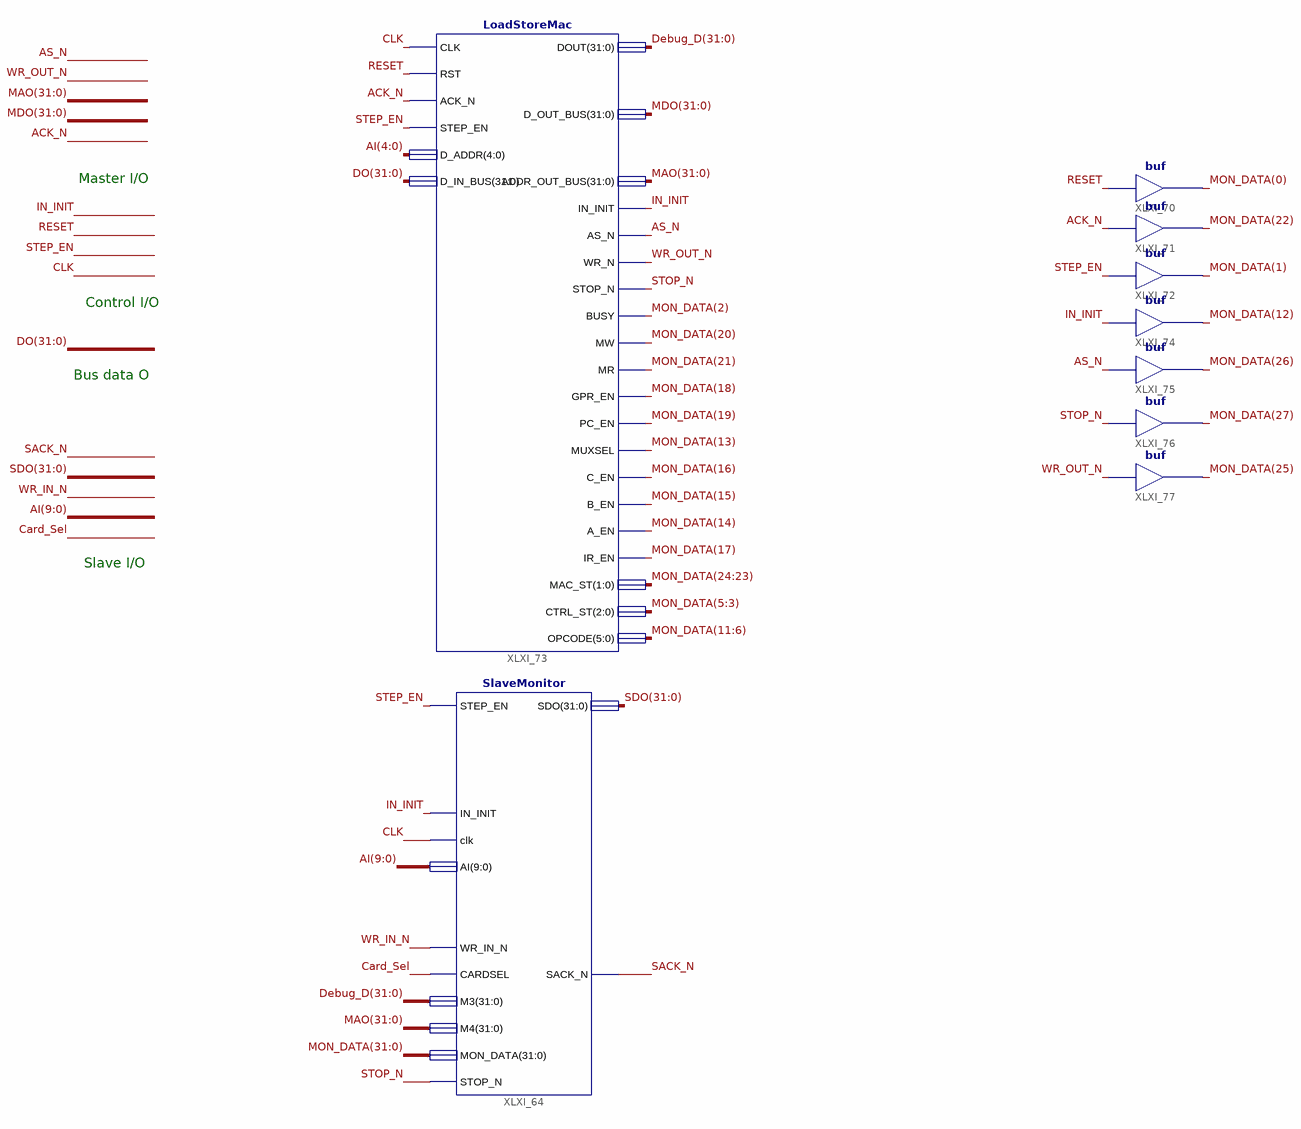
[diagram p0: schematic sheet 1]
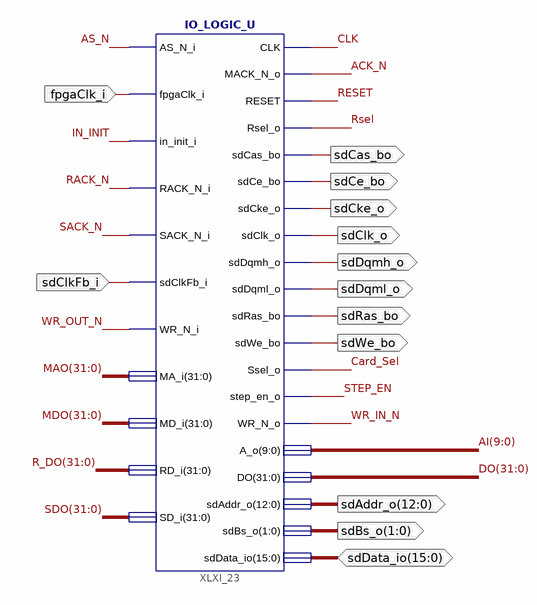
[diagram p1: schematic sheet 2]
// Xilinx ISE schematic Top_Level.sch (spartan6) as structural Verilog: 10 symbols, 13 ports
module Top_Level (
  input  fpgaClk_i,
  input  sdClkFb_i,
  inout  [15:0] sdData_io,
  output sdClk_o,
  output [1:0] sdBs_o,
  output sdDqml_o,
  output sdDqmh_o,
  output sdWe_bo,
  output sdCas_bo,
  output sdRas_bo,
  output sdCe_bo,
  output sdCke_o,
  output [12:0] sdAddr_o
);

  wire ACK_N, AS_N, Card_Sel, CLK, IN_INIT, RACK_N, RESET, Rsel, SACK_N, STEP_EN, STOP_N, WR_IN_N, WR_OUT_N;
  wire [9:0] AI;
  wire [31:0] Debug_D, DO, MAO, MDO, MON_DATA, R_DO, SDO;

  IO_LOGIC_U XLXI_23 (
    .AS_N_i(AS_N), .fpgaClk_i(fpgaClk_i), .in_init_i(IN_INIT), .RACK_N_i(RACK_N), .SACK_N_i(SACK_N),
    .sdClkFb_i(sdClkFb_i), .WR_N_i(WR_OUT_N), .MA_i(MAO), .MD_i(MDO), .RD_i(R_DO), .SD_i(SDO), .CLK(CLK),
    .MACK_N_o(ACK_N), .RESET(RESET), .Rsel_o(Rsel), .sdCas_bo(sdCas_bo), .sdCe_bo(sdCe_bo),
    .sdCke_o(sdCke_o), .sdClk_o(sdClk_o), .sdDqmh_o(sdDqmh_o), .sdDqml_o(sdDqml_o), .sdRas_bo(sdRas_bo),
    .sdWe_bo(sdWe_bo), .Ssel_o(Card_Sel), .step_en_o(STEP_EN), .WR_N_o(WR_IN_N), .A_o(AI), .DO(DO),
    .sdAddr_o(sdAddr_o), .sdBs_o(sdBs_o), .sdData_io(sdData_io));
  buf XLXI_70 (MON_DATA[0], RESET);
  buf XLXI_71 (MON_DATA[22], ACK_N);
  buf XLXI_72 (MON_DATA[1], STEP_EN);
  LoadStoreMac XLXI_73 (
    .CLK(CLK), .RST(RESET), .ACK_N(ACK_N), .STEP_EN(STEP_EN), .D_ADDR(AI[4:0]), .D_IN_BUS(DO),
    .BUSY(MON_DATA[2]), .IN_INIT(IN_INIT), .MW(MON_DATA[20]), .MR(MON_DATA[21]), .GPR_EN(MON_DATA[18]),
    .PC_EN(MON_DATA[19]), .MUXSEL(MON_DATA[13]), .C_EN(MON_DATA[16]), .B_EN(MON_DATA[15]),
    .A_EN(MON_DATA[14]), .IR_EN(MON_DATA[17]), .DOUT(Debug_D), .D_OUT_BUS(MDO), .ADDR_OUT_BUS(MAO),
    .AS_N(AS_N), .WR_N(WR_OUT_N), .STOP_N(STOP_N), .MAC_ST(MON_DATA[24:23]), .CTRL_ST(MON_DATA[5:3]),
    .OPCODE(MON_DATA[11:6]));
  SlaveMonitor XLXI_64 (
    .clk(CLK), .AI(AI), .M3(Debug_D), .M4(MAO), .WR_IN_N(WR_IN_N), .CARDSEL(Card_Sel), .STEP_EN(STEP_EN),
    .IN_INIT(IN_INIT), .MON_DATA(MON_DATA), .STOP_N(STOP_N), .SACK_N(SACK_N), .SDO(SDO));
  buf XLXI_74 (MON_DATA[12], IN_INIT);
  buf XLXI_75 (MON_DATA[26], AS_N);
  buf XLXI_76 (MON_DATA[27], STOP_N);
  buf XLXI_77 (MON_DATA[25], WR_OUT_N);

  // Notes on the sheet:
  //   Master I/O
  //   Control I/O
  //   Bus data O
  //   Slave I/O
endmodule
